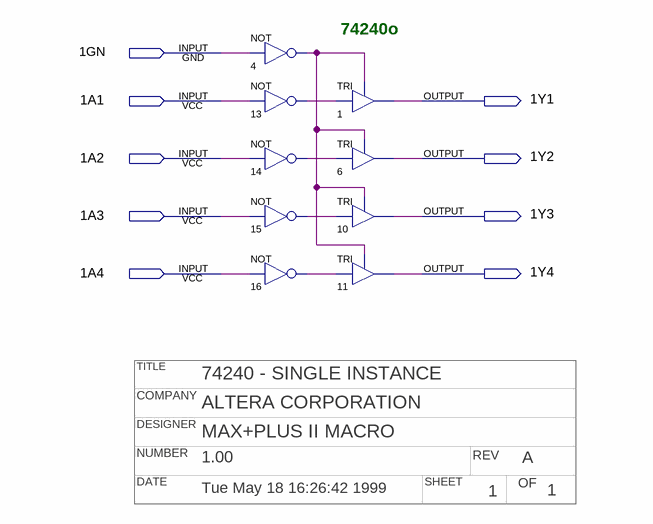
[diagram p0: schematic sheet]
// Quartus schematic 74240o.bdf as structural Verilog: 9 symbols, 9 pins
// Title block: TITLE: 74240 - SINGLE INSTANCE; COMPANY: ALTERA CORPORATION; DESIGNER: MAX+PLUS II MACRO; NUMBER: 1.00; REV: A; DATE: Tue May 18 16:26:42 1999; SHEET: 1; OF: 1
module \74240o  (
  input  \1GN ,
  input  \1A1 ,
  input  \1A2 ,
  input  \1A3 ,
  input  \1A4 ,
  output \1Y1 ,
  output \1Y2 ,
  output \1Y3 ,
  output \1Y4 
);

  wire n4_out, n13_out, n14_out, n15_out, n16_out;

  not u_4 (n4_out, \1GN );
  not u_13 (n13_out, \1A1 );
  not u_14 (n14_out, \1A2 );
  not u_15 (n15_out, \1A3 );
  not u_16 (n16_out, \1A4 );
  TRI u_1 (.IN(n13_out), .OE(n4_out), .OUT(\1Y1 ));
  TRI u_6 (.IN(n14_out), .OE(n4_out), .OUT(\1Y2 ));
  TRI u_10 (.IN(n15_out), .OE(n4_out), .OUT(\1Y3 ));
  TRI u_11 (.IN(n16_out), .OE(n4_out), .OUT(\1Y4 ));

  // Notes on the sheet:
  //   74240o
endmodule
